# EAGLE design USB_FTDI (EAGLE 9.6.1)
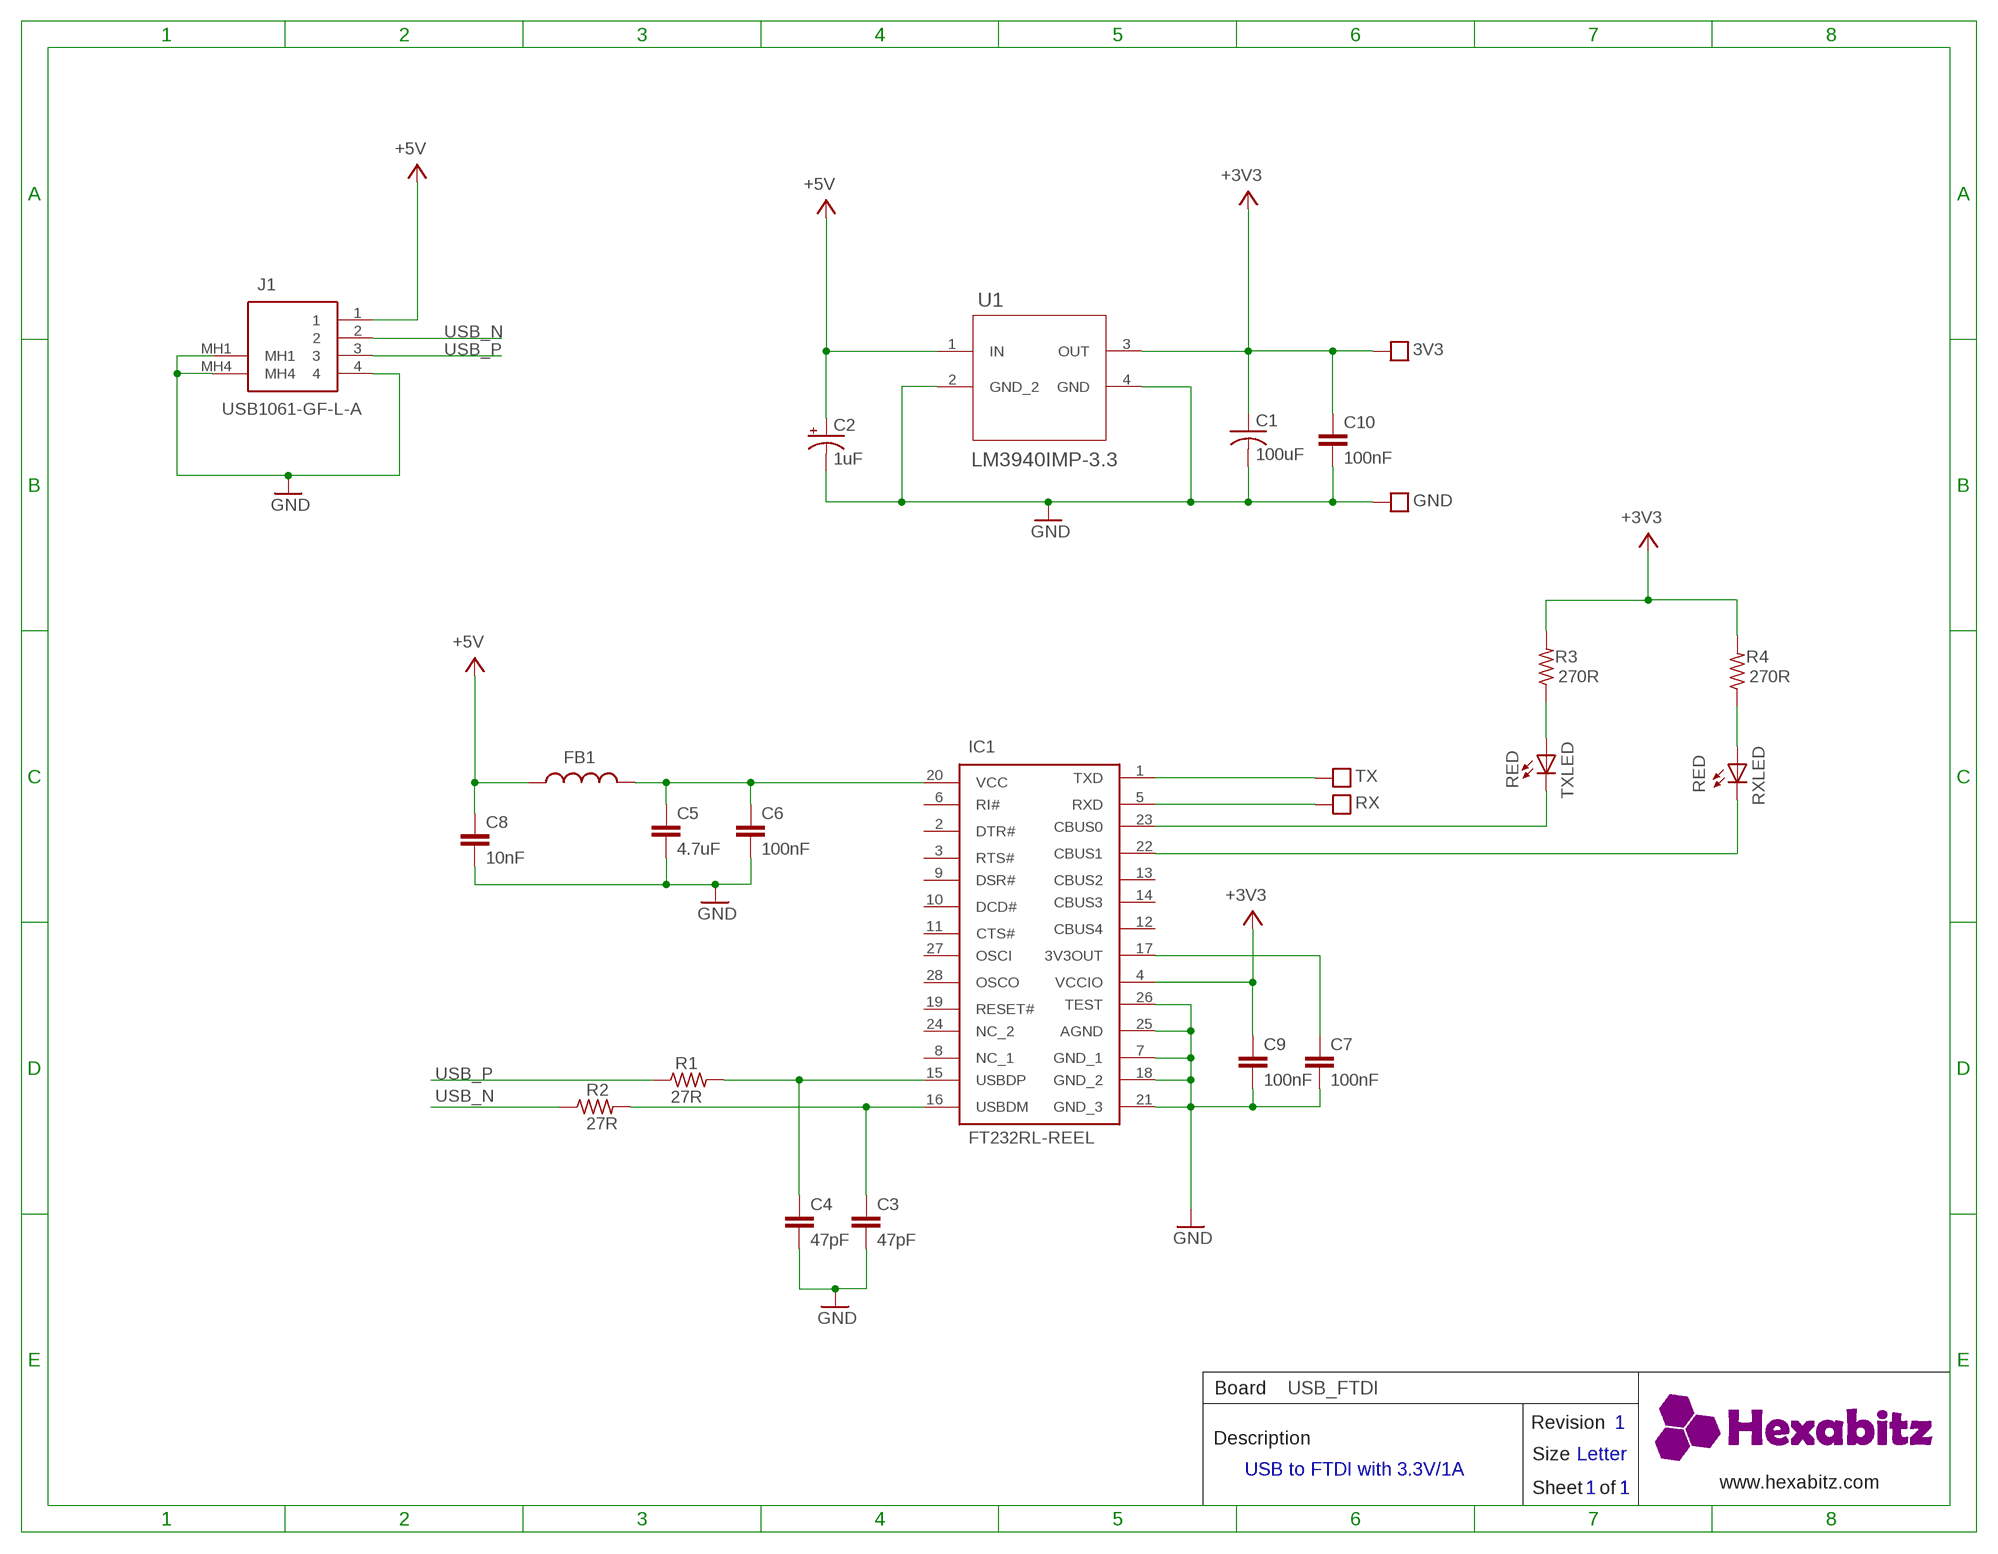
[diagram p0: schematic, sheet 1]

## Parts
3V3  PAD5  [PAD5]
C1  100uF  C-1210  [C-1210]
C2  1uF  C-0805-POL  [C-0805-POL]
C3  47pF  C-0603  [C-0603]
C4  47pF  C-0603  [C-0603]
C5  4.7uF  C-0805  [C-0805]
C6  100nF  C-0603  [C-0603]
C7  100nF  C-0603  [C-0603]
C8  10nF  C-0603  [C-0603]
C9  100nF  C-0603  [C-0603]
C10  100nF  C-0603  [C-0603]
FB1  FB-0603  [FB-0603]
GND  PAD5  [PAD5]
IC1  FT232RL-REEL  [SOP65P778X200-28N]
J1  USB1061-GF-L-A  [USB1061GFLA]
R1  27R  R-0603  [R-0603]
R2  27R  R-0603  [R-0603]
R3  270R  R-0603  [R-0603]
R4  270R  R-0603  [R-0603]
RX  PAD5  [PAD5]
RXLED  RED  VLMS1300-GS08  [VLMS1300-GS08]
TX  PAD5  [PAD5]
TXLED  RED  VLMS1300-GS08  [VLMS1300-GS08]
U1  LM3940IMP-3.3  [SOT230P696X180-4N]

## Nets
+3V3: 3V3.P$1 3V3.P$2 C1.1 C9.1 C10.1 IC1.4(VCCIO) R3.2 R4.2 U1.3(OUT)
+5V: C2.1(+) C8.1 FB1.1 J1.1 U1.1(IN)
GND: C1.2 C2.2(-) C3.2 C4.2 C5.2 C6.2 C7.2 C8.2 C9.2 C10.2 GND.P$1 GND.P$2 IC1.7(GND_1) IC1.18(GND_2) IC1.21(GND_3) IC1.25(AGND) IC1.26(TEST) J1.4 J1.MH1 J1.MH4 U1.2(GND_2) U1.4(GND)
N$1: R4.1 RXLED.A
N$2: R3.1 TXLED.A
N$3: IC1.1(TXD) TX.P$1 TX.P$2
N$4: IC1.5(RXD) RX.P$1 RX.P$2
N$5: C5.1 C6.1 FB1.2 IC1.20(VCC)
N$6: IC1.23(CBUS0) TXLED.C
N$7: IC1.22(CBUS1) RXLED.C
N$9: C7.1 IC1.17(3V3OUT)
USB_N: J1.2 R2.1
USB_P: J1.3 R1.1
USBF_N: C3.1 IC1.16(USBDM) R2.2
USBF_P: C4.1 IC1.15(USBDP) R1.2
Unconnected: IC1.2(DTR#) IC1.3(RTS#) IC1.6(RI#) IC1.8(NC_1) IC1.9(DSR#) IC1.10(DCD#) IC1.11(CTS#) IC1.12(CBUS4) IC1.13(CBUS2) IC1.14(CBUS3) IC1.19(RESET#) IC1.24(NC_2) IC1.27(OSCI) IC1.28(OSCO)

## Notes on the sheet
- Board | USB_FTDI
- Revision | 1
- Description
- Size | Letter
- USB to FTDI with 3.3V/1A
- www.hexabitz.com
- Sheet   of | 1 | 1
- C:/Users/Admin/Desktop/logodraft.bmp

## Library data of the parts
3V3 GND RX TX = HEXABITZ_CONNECTION_PARTS:PAD5
C1 = HEXABITZ_RCLS:C-1210: Cap Tant Solid SMD 1210
C2 = HEXABITZ_RCLS:C-0805-POL: Cap Tant Solid SMD 2012
C3 C4 C6-C10 = HEXABITZ_RCLS:C-0603: CAP CER 10% X7R 0603
C5 = HEXABITZ_RCLS:C-0805: CAP CER 10% X7R 0805
FB1 = HEXABITZ_RCLS:FB-0603: Ferrite Beads Multi-Layer 0603
IC1 = HEXABITZ_ICs:FT232RL-REEL: USB/Serial IC UART SSOP-28 FTDI Chip FT232RL-REEL, USB Controller, 3MBd, USB 2.0, 1.8 5.25 V, 28-Pin SSOP Source: Datasheet <http://www.ftdichip.com/Support/Documents/DataSheets/ICs/DS_FT232R.pdf>; DESCRIPTION: USB/Serial IC UART SSOP-28 FTDI Chip FT232RL-REEL, USB Controller, 3MBd, USB 2.0, 1.8 5.25 V, 28-Pin SSOP; HEIGHT: 2mm; MANUFACTURER_NAME: FTDI Chip; MANUFACTURER_PART_NUMBER: FT232RL-REEL; MOUSER_PART_NUMBER: 895-FT232RL; MOUSER_PRICE-STOCK: https://www.mouser.co.uk/ProductDetail/FTDI/FT232RL-REEL?qs=D1%2FPMqvA103RC6OU6bKtoA%3D%3D
J1 = HEXABITZ_CONNECTION_PARTS:USB1061-GF-L-A: USB Connectors USB A Plug, SMT, R/A, GF, With Kinked shell stakes and posts, T&R Source: Datasheet <https://gct.co/connector/usb1061>; DESCRIPTION: USB Connectors USB A Plug, SMT, R/A, GF, With Kinked shell stakes and posts, T&R; HEIGHT: 4.6mm; MANUFACTURER_NAME: GCT (GLOBAL CONNECTOR TECHNOLOGY); MANUFACTURER_PART_NUMBER: USB1061-GF-L-A; MOUSER_PART_NUMBER: 640-USB1061-GF-L-A; MOUSER_PRICE-STOCK: https://www.mouser.co.uk/ProductDetail/GCT/USB1061-GF-L-A?qs=KUoIvG%2F9IlYSthVIrIBVzQ%3D%3D
R1-R4 = HEXABITZ_RCLS:R-0603: Thick Film Resistors - SMD 0603
RXLED TXLED = HEXABITZ_USER_INTERFACE_PARTS:VLMS1300-GS08: Red 0603 130° Clear 54 mcd 2 V Surface Mount ChipLED ; Octopart Url : http://octopart.com/vlms1300-gs08-vishay-21709201; MFN: Vishay; MPN: VLMS1300-GS08; OCTOPART_URL: https://octopart.com/vlms1300-gs08-vishay-21709201?r=sp&s=0nXJNjGsSbWwqfqWlZv0EA
U1 = HEXABITZ_ICs:LM3940IMP-3.3: Low Dropout Regulator; DESCRIPTION: Linear Voltage Regulator IC 1 Output 1A SOT-223-4; MFN: Texas Instruments; MPN: LM3940IMP-3.3/NOPB; OCTOPART_URL: https://octopart.com/lm3940imp-3.3%2Fnopb-texas+instruments-24823014?r=sp; PACKAGE: SOT-223 Texas Instruments

## Board
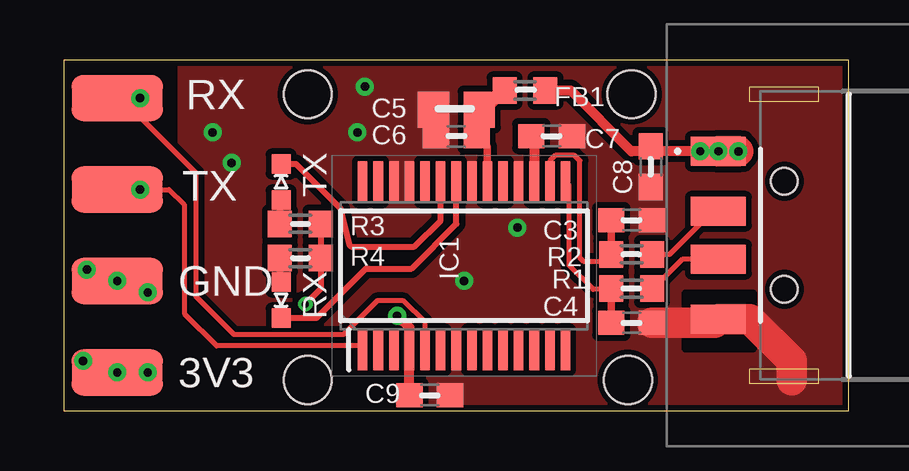
[diagram p1: board, top side]
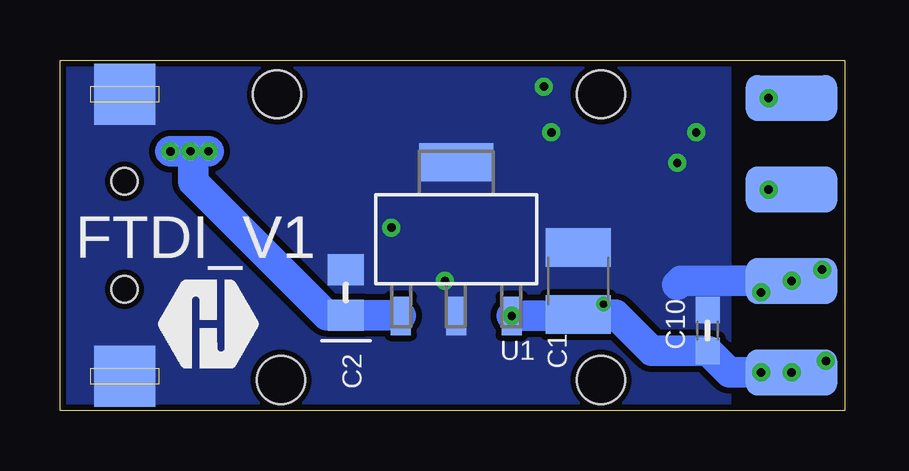
[diagram p2: board, bottom side, seen from below]

Size 32.7 x 14.61 mm. Coordinates in mm from the lower left corner, seen from the top.
Outline: 0,14.61 0,0 32.7,0 32.7,14.61 0,14.61
Copper layers (1*16): Top 0.035mm / dielectric 1.5mm / Bottom 0.035mm
Design rules "default *": minimum track width 6mil, minimum drill 0.2mm, track to track 6mil, track to pad 6mil, pad to pad 6mil, via to via 6mil, smd to smd 0mil, copper to edge 0.015mm, drill to drill 6mil, minimum pad ring 10mil, minimum via ring 4mil, stop-mask expansion 4mil, vias tented up to drill 24mil, thermal gap 10mil
Holes 2 mm at 10.16,1.27 10.16,13.18 23.65,13.18 23.49,1.27

### Footprints (pad centres in the part's own frame; a part is rotated, then mirrored left to right if it is on the bottom)
PAD5 = smd 3.81 x 1.93: P$1 0,0 | smd 3.81 x 1.93 bottom: P$2 0,0
C-1210 = smd 1.6 x 2.7: 1 -1.4,0; 2 1.4,0
C-0805-POL = smd 1.3 x 1.5: 1 -0.95,0; 2 0.95,0
C-0603 = smd 1.1 x 1: 1 -0.85,0; 2 0.85,0
C-0805 = smd 1.3 x 1.5: 1 -0.95,0; 2 0.95,0
FB-0603 = smd 1 x 1.1: 1 -0.85,0; 2 0.85,0
SOP65P778X200-28N = smd 1.7 x 0.4: 1 -3.5,4.225; 2 -3.5,3.575; 3 -3.5,2.925; 4 -3.5,2.275; 5 -3.5,1.625; 6 -3.5,0.975; 7 -3.5,0.325; 8 -3.5,-0.325; 9 -3.5,-0.975; 10 -3.5,-1.625; 11 -3.5,-2.275; 12 -3.5,-2.925; 13 -3.5,-3.575; 14 -3.5,-4.225; 15 3.5,-4.225; 16 3.5,-3.575; 17 3.5,-2.925; 18 3.5,-2.275; 19 3.5,-1.625; 20 3.5,-0.975; 21 3.5,-0.325; 22 3.5,0.325; 23 3.5,0.975; 24 3.5,1.625; 25 3.5,2.275; 26 3.5,2.925; 27 3.5,3.575; 28 3.5,4.225
USB1061GFLA = smd 1.2 x 2.3: 1 3.5,11.15; 2 1,11.15; 3 -1,11.15; 4 -3.5,11.15 | smd 2.54 x 2.54 bottom: MH1 -5.874,8.414; MH4 5.874,8.414 | hole 1.1: 2.25,8.4; -2.25,8.4
R-0603 = smd 1 x 1.1: 1 -0.85,0; 2 0.85,0
VLMS1300-GS08 = smd 0.8 x 0.8: A 0,0.75; C 0,-0.75
SOT230P696X180-4N = smd 1.6 x 0.838: 1 -3.2,2.311; 2 -3.2,0; 3 -3.2,-2.311 | smd 1.6 x 3.099: 4 3.2,0

### Placement (x,y rotation side)
3V3  2.22,1.59 0 top
C1  11.11,5.4 90 bottom
C2  20.8,4.92 90 bottom
C3  23.65,7.94 0 top
C4  23.65,3.65 0 top
C5  16.35,12.54 180 top
C6  16.35,11.43 180 top
C7  20.32,11.43 0 top
C8  24.45,10.16 270 top
C9  15.24,0.64 0 top
C10  5.71,3.33 90 bottom
FB1  19.21,13.34 180 top
GND  2.22,5.4 0 top
IC1  16.67,6.03 90 top
J1  38.42,7.3 90 top
R1  23.65,5.08 180 top
R2  23.65,6.51 180 top
R3  9.84,7.78 0 top
R4  9.84,6.35 0 top
RX  2.22,13.02 0 top
RXLED  9.05,4.6 0 top
TRIMBLE-LOGO1  HEXA-LOGO  [HEXA-LOGO]  26.51,1.75 0 bottom
TX  2.22,9.21 0 top
TXLED  9.05,9.53 180 top
U1  16.19,7.14 90 bottom

### Tracks (layer width: path | path; a pad name or v marks a point on that pad's centre or on a via)
+3V3  (via drill 0.3 pad 0.6, 0.35 pad 0.75)
  Top 0.254: R3.2 R4.2 10.69,5.07 v10.06,4.43
  Top 0.406: C9.1 IC1.4 14.39,3.46 14.12,3.74 14.09,3.74 U1.3
  Bottom 0.254: U1.3 10.66,3.94 10.06,4.54 v10.06,4.43 | v3.49,1.59 3V3.P$1 1.27,1.59 v0.79,2.06
  Bottom 1.27: U1.3 11.17,3.94 C1.1 9.55,4 8.04,2.48 C10.1 4.82,1.59 v3.49,1.59
  other vias: 13.88,3.94 2.22,1.59
+5V  (via drill 0.35 pad 0.75)
  Top 0.406: FB1.1 21.11,13.34 23.65,10.8 24.24,10.8 C8.1 24.66,10.8 v27.27,10.8
  Top 0.813: v26.51,10.8 27.51,10.8
  Top 1.27: v28.1,10.79 J1.1 v27.27,10.8
  Bottom 0.305: v27.27,10.8 v27.26,10.79 27.15,10.79
  Bottom 1.27: 27.15,10.79 27.15,9.53 21.59,3.97 C2.1 18.53,3.97 U1.1 | v28.1,10.79 28.09,10.8 v27.27,10.8 v26.51,10.8
GND  (via drill 0.35 pad 0.75)
  Top 0.254: GND.P$1 3.02,5.4 v3.49,4.92
  Top 1.27: C4.2 27.12,3.65 J1.4 28.58,3.8 30.32,2.06 30.32,1.27
  Bottom 0.254: GND.P$1 1.43,5.4 v0.95,5.87
  Bottom 1.27: GND.P$1 6.83,5.4 6.99,5.24
  other vias: 2.22,5.4 18.89,7.62 16.67,5.4 12.54,13.49 12.22,11.59 6.19,11.59 6.98,10.32
  pour Top (isolate 0.254, rank 2, no thermals): -0.16,14.61 32.7,14.61 32.7,0 -0.16,0
  pour Bottom (isolate 0.254, rank 2, no thermals): -0.16,14.61 32.7,14.61 32.7,0 -0.16,0
  cutout Bottom: -0.16,14.61 4.6,14.61 4.6,-0.16 0,-0.16 -0.16,0
  cutout Top: -0.16,14.61 4.6,14.61 4.6,-0.16 0,-0.16 -0.16,0
  cutout Top: 25.88,4.92 28.73,4.92 28.73,2.54 25.88,2.54
N$1
  Top 0.254: RXLED.A 8.99,5.41 R4.1
N$2
  Top 0.254: TXLED.A 8.99,8.72 R3.1
N$3  (via drill 0.35 pad 0.75)
  Top 0.203: IC1.1 12.28,2.69 6.36,2.69 5.02,4.03 5.02,8.57 4.38,9.21 v3.17,9.21 TX.P$2
  Bottom 0.406: TX.P$2 v3.17,9.21
N$4  (via drill 0.35 pad 0.75)
  Top 0.203: RX.P$2 2.38,13.02 5.5,9.9 5.5,4.76 7.09,3.17 11.64,3.17 13.05,4.57 14.14,4.57 15.04,3.67 IC1.5
  Top 0.406: RX.P$2 v3.17,13.02
  Bottom 0.406: v3.17,13.02 RX.P$2
N$5
  Top 0.305: FB1.2 18.36,13.65 | C6.1 17.64,10.99 IC1.20
  Top 0.406: FB1.2 17.57,12.54 C5.1 17.2,12.44 C6.1
N$6
  Top 0.254: IC1.23 15.69,7.92 14.61,6.83 11.97,6.83 11.9,6.89 11.52,8.42 9.67,10.28 TXLED.C
N$7
  Top 0.254: IC1.22 16.35,7.78 14.49,5.92 12.58,5.92 10.52,3.85 RXLED.C
N$9
  Top 0.406: C7.1 19.59,11.31 IC1.17
USB_N
  Top 0.203: R2.1 25.24,6.51 27.03,8.3 J1.2
USB_P
  Top 0.203: J1.3 25.76,6.3 24.54,5.08 R1.1
USBF_N
  Top 0.203: R2.2 22.5,6.21 21.66,6.21 21.5,6.37 21.5,10.41 21.27,10.64 20.48,10.64 20.24,10.4 IC1.16
  Top 0.305: C3.1 R2.2
USBF_P
  Top 0.203: IC1.15 21.05,9.37 21.05,6.04 22.05,5.04 22.77,5.04 R1.2
  Top 0.305: C4.1 22.8,5.01 22.77,5.04

### Text on the board
bPlace: FTDI_V1
tNames: TX | RX